# EAGLE design serial_one_plug (EAGLE 6.5.0)
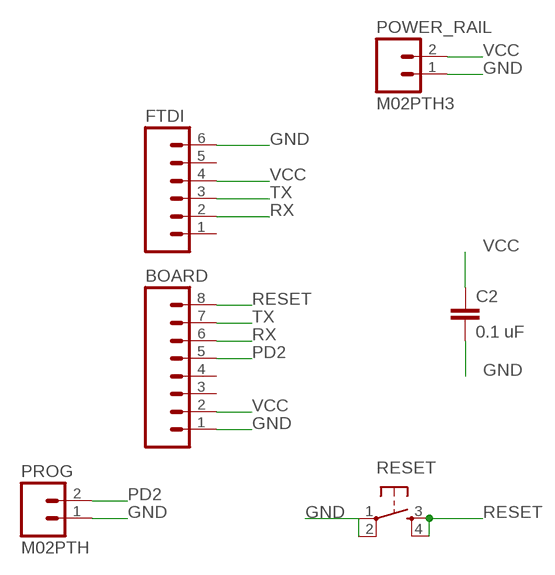
[diagram p0: schematic, sheet 1]

## Parts
BOARD  M08LONGPADS  [1X08_LONGPADS]
C2  0.1 uF  C-EUC1206  [C1206]
FTDI  M06LONGPADS  [1X06_LONGPADS]
POWER_RAIL  M02PTH3  [1X02_LONGPADS]
PROG  M02PTH  [1X02]
RESET  TAC_SWITCHPTH  [TACTILE-PTH]

## Nets
GND: BOARD.1 C2.2 FTDI.6 POWER_RAIL.1 PROG.1 RESET.1 RESET.2
PD2: BOARD.5 PROG.2
RESET: BOARD.8 RESET.3 RESET.4
RX: BOARD.6 FTDI.2
TX: BOARD.7 FTDI.3
VCC: BOARD.2 C2.1 FTDI.4 POWER_RAIL.2
Unconnected: BOARD.3 BOARD.4 FTDI.1 FTDI.5

## Library data of the parts
BOARD = SparkFun-Connectors:M08: Header 8 Standard 8-pin 0.1" header. Use with straight break away headers (SKU : PRT-00116), right angle break away headers (PRT-00553), swiss pins (PRT-00743), machine pins (PRT-00117), and female headers (PRT-00115).
C2 = rcl:C-EU: CAPACITOR, European symbol
FTDI = SparkFun-Connectors:M06: Header 6 Standard 6-pin 0.1" header. Use with straight break away headers (SKU : PRT-00116), right angle break away headers (PRT-00553), swiss pins (PRT-00743), machine pins (PRT-00117), and female headers (PRT-00115). Molex polarized connector foot print use with SKU : PRT-08094 with associated crimp pins and housings. NOTES ON THE VARIANTS LOCK and LOCK_LONGPADS... This footprint was designed to help hold the alignment of a through-hole component (i.e. 6-pin header) while soldering it into place. You may notice that each hole has been shifted either up or down by 0.005 of an inch from it's more standard position (which is a perfectly straight line). This slight alteration caused the pins (the squares in the middle) to touch the edges of the holes. Because they are alternating, it causes a "brace" to hold the component in place. 0.005 has proven to be the perfect amount of "off-center" position when using our standard breakaway headers. Although looks a little odd when you look at the bare footprint, once you have a header in there, the alteration is very hard to notice. Also,if you push a header all the way into place, it is covered up entirely on the bottom side. This idea of altering the position of holes to aid alignment will be further integrated into the Sparkfun Library for other footprints. It can help hold any component with 3 or more connection pins.
POWER_RAIL PROG = SparkFun-Connectors:M02: Standard 2-pin 0.1" header. Use with - straight break away headers ( PRT-00116) - right angle break away headers (PRT-00553) - swiss pins (PRT-00743) - machine pins (PRT-00117) - female headers (PRT-00115) Molex polarized connector foot print use with: PRT-08233 with associated crimp pins and housings. 2.54_SCREWTERM for use with PRT-10571. 3.5mm Screw Terminal footprints for PRT-08084 5mm Screw Terminal footprints for use with PRT-08433
RESET = SparkFun-Electromechanical:TAC_SWITCH: Momentary Switch Button commonly used for reset or general input. Spark Fun Electronics SKU : COM-00097 SMT- SWCH-08247

## Board
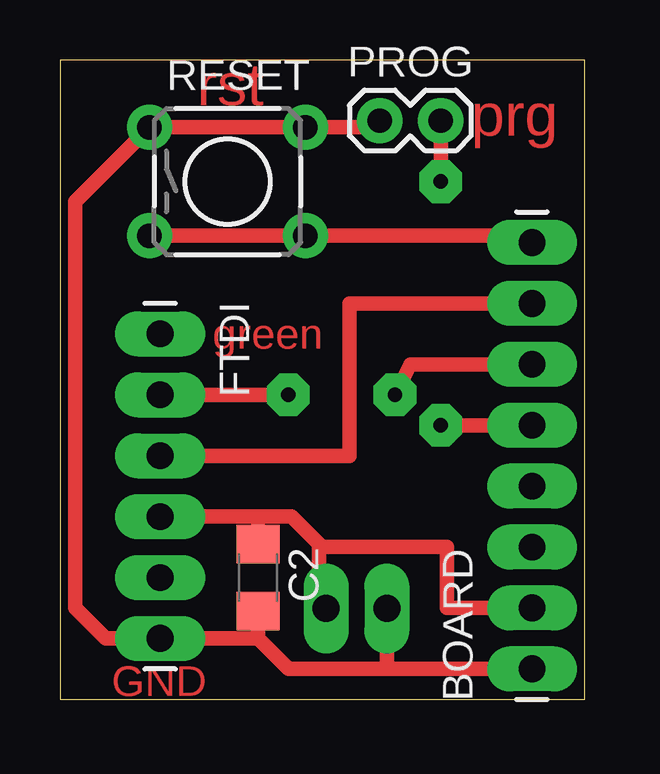
[diagram p1: board, top side]
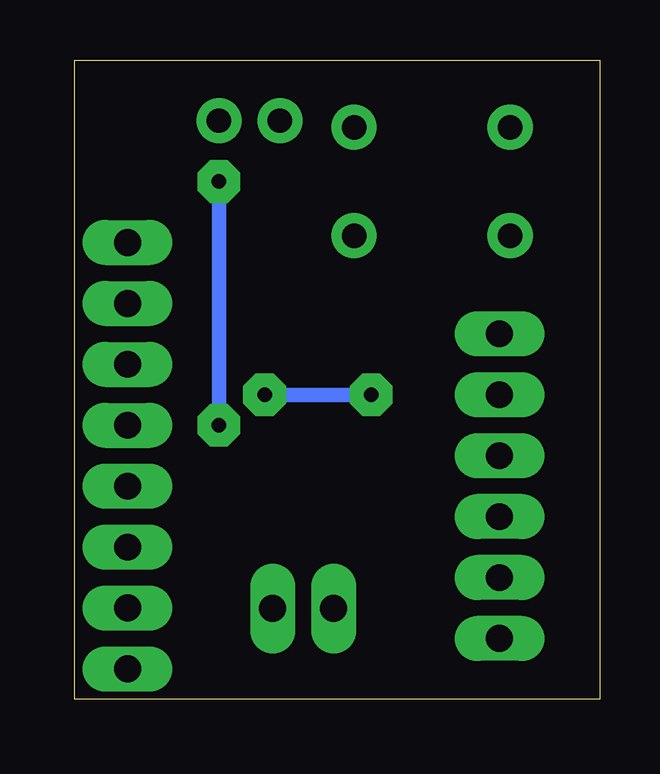
[diagram p2: board, bottom side, seen from below]

Size 21.89 x 26.66 mm. Coordinates in mm from the lower left corner, seen from the top.
Outline: 0,0 21.89,0 21.89,26.66 0,26.66 0,0
Copper layers (1*16): Top 0.035mm / dielectric 1.5mm / Bottom 0.035mm
Design rules "default": minimum track width 10mil, minimum drill 24mil, track to track 8mil, track to pad 8mil, pad to pad 8mil, via to via 8mil, smd to smd 8mil, copper to edge 40mil, drill to drill 8mil, minimum pad ring 10mil, minimum via ring 8mil, stop-mask expansion 4mil, vias tented up to drill 0mil, thermal gap 10mil

### Footprints (pad centres in the part's own frame; a part is rotated, then mirrored left to right if it is on the bottom)
1X08_LONGPADS = drill 1.118 pad 1.88 long: 1 0,0; 2 2.54,0; 3 5.08,0; 4 7.62,0; 5 10.16,0; 6 12.7,0; 7 15.24,0; 8 17.78,0
C1206 = smd 1.6 x 1.8: 1 -1.4,0; 2 1.4,0
1X06_LONGPADS = drill 1.118 pad 1.88 long: 1 0,0; 2 2.54,0; 3 5.08,0; 4 7.62,0; 5 10.16,0; 6 12.7,0
1X02_LONGPADS = drill 1.118 pad 1.88 long: 1 0,0; 2 2.54,0
1X02 = drill 1.016 pad 1.88: 1 0,0; 2 2.54,0
TACTILE-PTH = drill 1.016 pad 1.88: 1 -3.251,2.261; 2 3.251,2.261; 3 -3.251,-2.261; 4 3.251,-2.261

### Placement (x,y rotation side)
BOARD  19.69,1.27 90 top
C2  8.25,5.08 270 top
FTDI  4.17,15.24 270 top
POWER_RAIL  13.63,3.79 180 top
PROG  13.33,24.13 0 top
RESET  6.99,21.59 0 top

### Tracks (layer width: path | path; a pad name or v marks a point on that pad's centre or on a via)
GND
  Top 0.61: 8.25,2.54 FTDI.6 1.91,2.54 0.64,3.81 0.64,20.75 RESET.1 RESET.2 13.06,23.85 PROG.1 | BOARD.1 13.63,1.27 | 13.63,1.27 POWER_RAIL.1 | 13.63,1.27 9.53,1.27 8.25,2.54 | 8.25,2.54 C2.2
PD2  (via drill 0.6 pad 1.78)
  Top 0.61: PROG.2 v15.88,21.59 | v15.88,11.43 BOARD.5
  Bottom 0.61: v15.88,21.59 v15.88,11.43
RESET
  Top 0.61: RESET.3 RESET.4 19.41,19.33 BOARD.8
RX  (via drill 0.6 pad 1.78)
  Top 0.61: FTDI.2 v9.53,12.7 | v13.97,12.7 14.6,13.97 BOARD.6
  Bottom 0.61: v9.53,12.7 v13.97,12.7
TX
  Top 0.61: FTDI.3 12.06,10.16 12.06,16.51 BOARD.7
VCC
  Top 0.61: FTDI.4 8.25,7.62 | 8.25,7.62 9.65,7.62 10.79,6.48 10.79,6.35 | 10.79,6.35 10.79,5.08 11.09,5.08 POWER_RAIL.2 | BOARD.2 16.13,3.81 16.13,6.35 10.79,6.35 | C2.1 8.25,7.62

### Text on the board
Top: rst | prg | green | GND